# Altium project TankBoard.PrjPCB
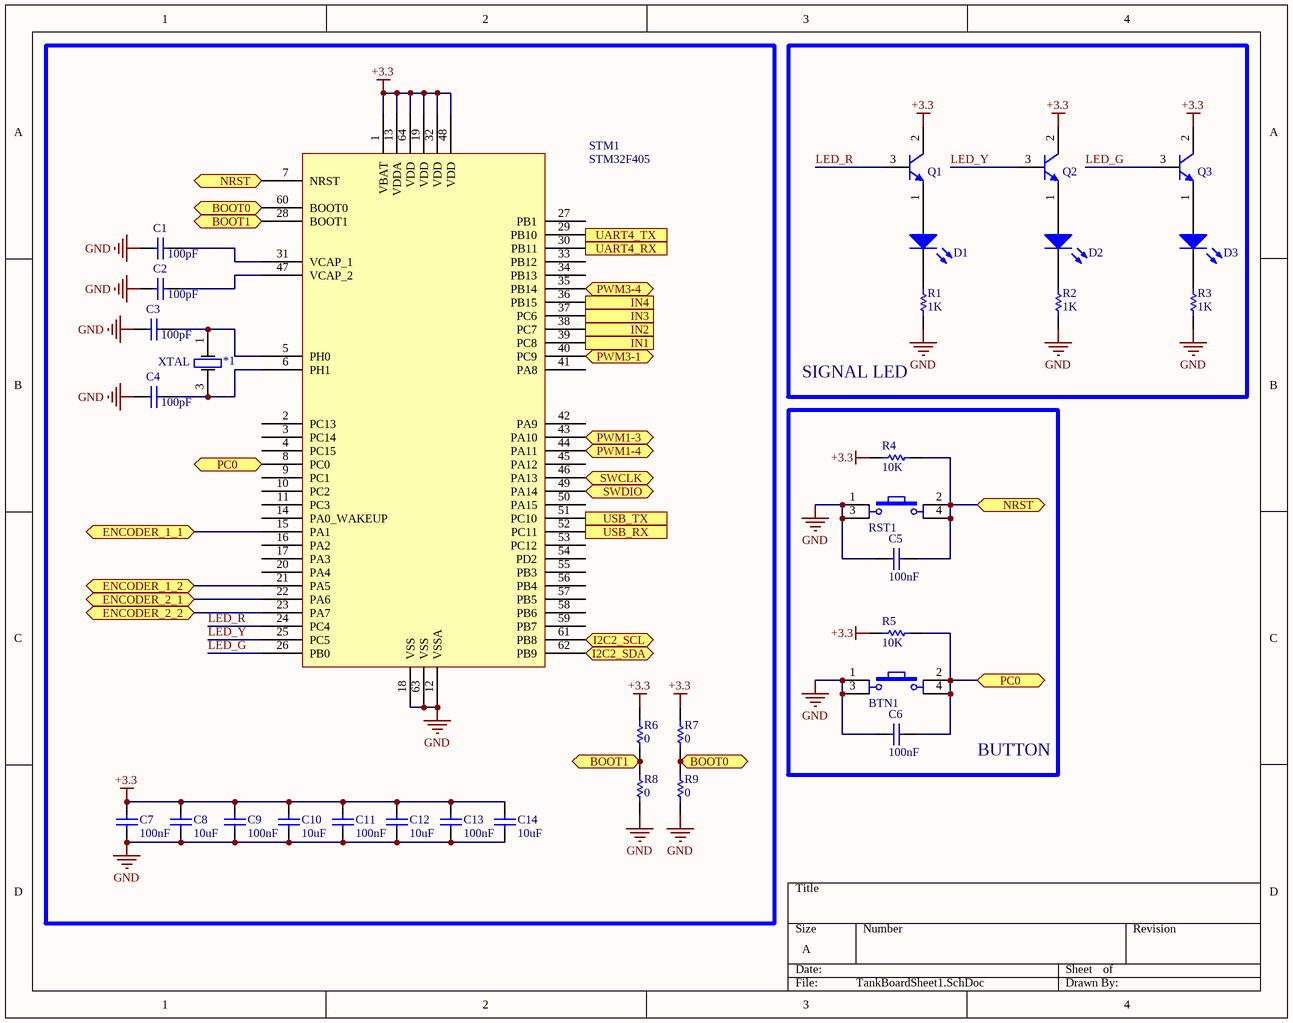
[diagram p0: TankBoardSheet1.SchDoc]
4 sheets, 87 parts. Net scope: flat (ports and power ports of the same name join across sheets).
Board file: TankBoardPCB1.PcbDoc
Sheets:
  TankBoardSheet1.SchDoc
  TankBoardSheet2.SchDoc
  TankBoardSheet3.SchDoc
  TankBoardSheet4.SchDoc

## Sheet TankBoardSheet1.SchDoc
size A

### Parts
*1  XTAL  [XTAL SMD 4PIN]
BTN1  SW  [Tact SW 4 pin]  (value not drawn)
C1  value 100pF  [CAP-SM-0603]  (hidden comment: Cap Non-Pol SMD)
C2  value 100pF  [CAP-SM-0603]  (hidden comment: Cap Non-Pol SMD)
C3  value 100pF  [CAP-SM-0603]  (hidden comment: Cap Non-Pol SMD)
C4  value 100pF  [CAP-SM-0603]  (hidden comment: Cap Non-Pol SMD)
C5  value 100nF  [CAP-SM-0603]  (hidden comment: Cap Non-Pol SMD)
C6  value 100nF  [CAP-SM-0603]  (hidden comment: Cap Non-Pol SMD)
C7  value 100nF  [CAP-SM-0603]  (hidden comment: Cap Non-Pol SMD)
C8  value 10uF  [CAP-SM-0603]  (hidden comment: Cap Non-Pol SMD)
C9  value 100nF  [CAP-SM-0603]  (hidden comment: Cap Non-Pol SMD)
C10  value 10uF  [CAP-SM-0603]  (hidden comment: Cap Non-Pol SMD)
C11  value 100nF  [CAP-SM-0603]  (hidden comment: Cap Non-Pol SMD)
C12  value 10uF  [CAP-SM-0603]  (hidden comment: Cap Non-Pol SMD)
C13  value 100nF  [CAP-SM-0603]  (hidden comment: Cap Non-Pol SMD)
C14  value 10uF  [CAP-SM-0603]  (hidden comment: Cap Non-Pol SMD)
D1  LED SMD  [LED_0603_Blue]  (value not drawn)
D2  LED SMD  [LED_0603_Blue]  (value not drawn)
D3  LED SMD  [LED_0603_Blue]  (value not drawn)
Q1  C1815  [SOT23B]  (value not drawn)
Q2  C1815  [SOT23B]  (value not drawn)
Q3  C1815  [SOT23B]  (value not drawn)
R1  value 1K  [RES-SM-0603]  (hidden comment: RESISTOR SMD)
R2  value 1K  [RES-SM-0603]  (hidden comment: RESISTOR SMD)
R3  value 1K  [RES-SM-0603]  (hidden comment: RESISTOR SMD)
R4  value 10K  [RES-SM-0603]  (hidden comment: RESISTOR SMD)
R5  value 10K  [RES-SM-0603]  (hidden comment: RESISTOR SMD)
R6  value 0  [RES-SM-0603]  (hidden comment: RESISTOR SMD)
R7  value 0  [RES-SM-0603]  (hidden comment: RESISTOR SMD)
R8  value 0  [RES-SM-0603]  (hidden comment: RESISTOR SMD)
R9  value 0  [RES-SM-0603]  (hidden comment: RESISTOR SMD)
RST1  SW  [Tact SW 4 pin]  (value not drawn)
STM1  STM32F405  [CQFP50P1150X1150X160-64N]

### Blocks framed on the sheet
SIGNAL LED: D1-D3 Q1-Q3 R1-R3
BUTTON: BTN1 C5 C6 R4 R5 RST1

### Ports
BOOT0 (bidir), BOOT1 (bidir), ENCODER_1_1 (bidir), ENCODER_1_2 (bidir), ENCODER_2_1 (bidir), ENCODER_2_2 (bidir), I2C2_SCL (bidir), I2C2_SDA (bidir), IN1 (out), IN2 (out), IN3 (out), IN4 (out), NRST (bidir), PC0 (bidir), PWM1-3 (bidir), PWM1-4 (bidir), PWM3-1 (bidir), PWM3-4 (bidir), SWCLK (bidir), SWDIO (bidir), UART4_RX (in), UART4_TX (out), USB_RX (in), USB_TX (out)

### Nets
+3.3: C7.1 C8.1 C9.1 C10.1 C11.1 C12.1 C13.1 C14.1 Q1.2(C) Q2.2(C) Q3.2(C) R4.1 R5.1 R6.2 R7.2 STM1.1(VBAT) STM1.13(VDDA) STM1.19(VDD) STM1.32(VDD) STM1.48(VDD) STM1.64(VDD)
GND: BTN1.1 BTN1.3 C1.1 C2.1 C3.1 C4.1 C5.2 C6.2 C7.2 C8.2 C9.2 C10.2 C11.2 C12.2 C13.2 C14.2 R1.1 R2.1 R3.1 R8.1 R9.1 RST1.1 RST1.3 STM1.12(VSSA) STM1.18(VSS) STM1.63(VSS)
LED_G: Q3.3(B) STM1.26(PB0)
LED_R: Q1.3(B) STM1.24(PC4)
LED_Y: Q2.3(B) STM1.25(PC5)
Net*1_1: *1.1 C3.2 STM1.5(PH0)
Net*1_3: *1.3 C4.2 STM1.6(PH1)
Net*2_25: STM1.51(PC10) ; port USB_TX
Net*2_26: STM1.52(PC11) ; port USB_RX
Net*4_2: STM1.15(PA1) ; port ENCODER_1_1
Net*4_4: STM1.21(PA5) ; port ENCODER_1_2
Net*4_10: STM1.23(PA7) ; port ENCODER_2_2
Net*4_12: STM1.22(PA6) ; port ENCODER_2_1
NetBTN1_2: BTN1.2 BTN1.4 C6.1 R5.2 STM1.8(PC0) ; port PC0
NetC1_2: C1.2 STM1.31(VCAP_1)
NetC2_2: C2.2 STM1.47(VCAP_2)
NetC5_1: C5.1 R4.2 RST1.2 RST1.4 STM1.7(NRST) ; port NRST
NetD1_1: D1.1(A) Q1.1(E)
NetD1_2: D1.2(K) R1.2
NetD2_1: D2.1(A) Q2.1(E)
NetD2_2: D2.2(K) R2.2
NetD3_1: D3.1(A) Q3.1(E)
NetD3_2: D3.2(K) R3.2
NetP1_2: STM1.29(PB10) ; port UART4_TX
NetP1_3: STM1.30(PB11) ; port UART4_RX
NetP2_1: STM1.44(PA11) ; port PWM1-4
NetP3_1: STM1.46(PA13) ; port SWCLK
NetP3_4: STM1.49(PA14) ; port SWDIO
NetP4_1: STM1.43(PA10) ; port PWM1-3
NetP5_3: STM1.61(PB8) ; port I2C2_SCL
NetP5_4: STM1.62(PB9) ; port I2C2_SDA
NetP6_3: STM1.35(PB14) ; port PWM3-4
NetP6_4: STM1.36(PB15) ; port IN4
NetP6_5: STM1.37(PC6) ; port IN3
NetP6_6: STM1.38(PC7) ; port IN2
NetP6_7: STM1.39(PC8) ; port IN1
NetP6_8: STM1.40(PC9) ; port PWM3-1
NetR6_1: R6.1 R8.2 STM1.28(BOOT1) ; port BOOT1
NetR7_1: R7.1 R9.2 STM1.60(BOOT0) ; port BOOT0

Not connected (* = marked no-connect by the designer): STM1 2(PC13) 3(PC14) 4(PC15) 9(PC1) 10(PC2) 11(PC3) 14(PA0_WAKEUP) 16(PA2) 17(PA3) 20(PA4) 27(PB1) 33(PB12) 34(PB13) 41(PA8) 42(PA9) 45(PA12) 50(PA15) 53(PC12) 54(PD2) 55(PB3) 56(PB4) 57(PB5) 58(PB6) 59(PB7)

### Library data of the parts
BTN1 RST1 = Tact SW - 4Pin: Switch button 4 pin; Value: Button chip 4 pin
C1-C14 = Cap Non-Pol SMD: Capacitor
D1-D3 = LED SMD: LED
Q1-Q3 = C1815: NPN Bipolar Transistor
R1-R9 = RESISTOR SMD: Resistor

## Sheet TankBoardSheet2.SchDoc
size A
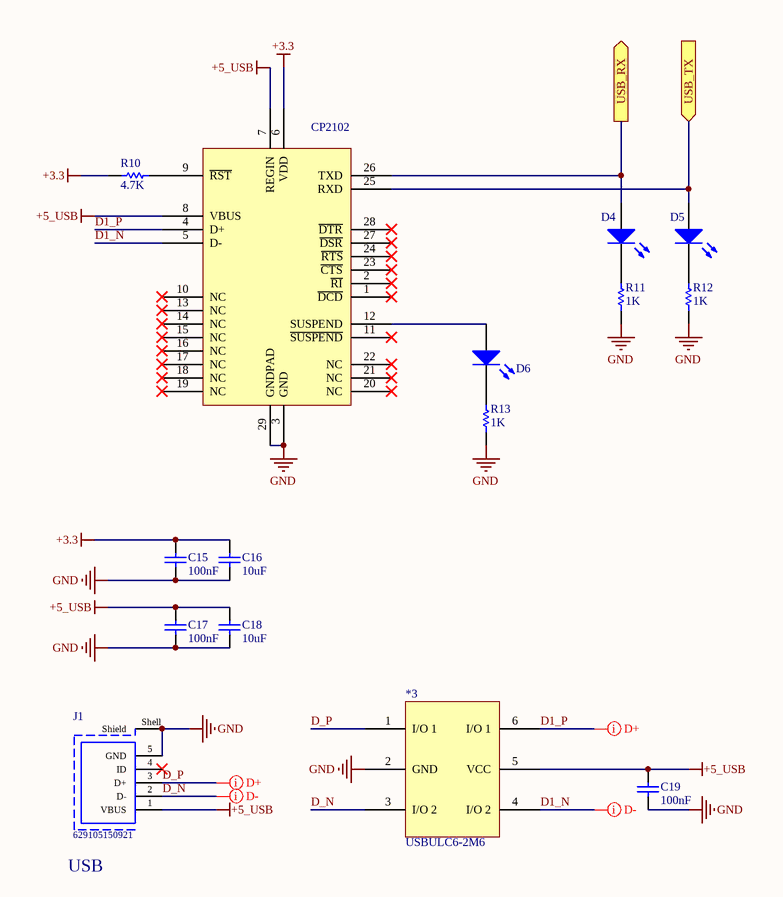
[diagram p1: TankBoardSheet2.SchDoc]

### Parts
*2  CP2102  [QFN50P500X500X90_HS-29N]
*3  USBULC6-2M6  [QFN50P100X145X60-6N]
C15  value 100nF  [CAP-SM-0603]  (hidden comment: Cap Non-Pol SMD)
C16  value 10uF  [CAP-SM-0603]  (hidden comment: Cap Non-Pol SMD)
C17  value 100nF  [CAP-SM-0603]  (hidden comment: Cap Non-Pol SMD)
C18  value 10uF  [CAP-SM-0603]  (hidden comment: Cap Non-Pol SMD)
C19  value 100nF  [CAP-SM-0603]  (hidden comment: Cap Non-Pol SMD)
D4  LED SMD  [LED_0603_Blue]  (value not drawn)
D5  LED SMD  [LED_0603_Blue]  (value not drawn)
D6  LED SMD  [LED_0603_Blue]  (value not drawn)
J1  629105150921  [629105150921]
R10  value 4.7K  [RES-SM-0603]  (hidden comment: RESISTOR SMD)
R11  value 1K  [RES-SM-0603]  (hidden comment: RESISTOR SMD)
R12  value 1K  [RES-SM-0603]  (hidden comment: RESISTOR SMD)
R13  value 1K  [RES-SM-0603]  (hidden comment: RESISTOR SMD)

### Ports
USB_RX (out), USB_TX (in)

### Nets
+3.3: *2.6(VDD) C15.1 C16.1 R10.2
+5_USB: *2.7(REGIN) *2.8(VBUS) *3.5(VCC) C17.1 C18.1 C19.1 J1.1(VBUS)
GND: *2.3(GND) *2.29(GNDPAD) *3.2(GND) C15.2 C16.2 C17.2 C18.2 C19.2 J1.5(GND) J1.Shell(Shield) R11.1 R12.1 R13.1
D1_N: *2.5(D-) *3.4(I/O_2)
D1_P: *2.4(D+) *3.6(I/O_1)
D_N: *3.3(I/O_2) J1.2(D-)
D_P: *3.1(I/O_1) J1.3(D+)
Net*2_9: *2.9(~{RST}) R10.1
Net*2_12: *2.12(SUSPEND) D6.1(A)
Net*2_25: *2.25(RXD) D5.1(A) ; port USB_TX
Net*2_26: *2.26(TXD) D4.1(A) ; port USB_RX
NetD4_2: D4.2(K) R11.2
NetD5_2: D5.2(K) R12.2
NetD6_2: D6.2(K) R13.2

Not connected (* = marked no-connect by the designer): *2 1(~{DCD})* 2(~{RI})* 10(NC)* 11(~{SUSPEND})* 13(NC)* 14(NC)* 15(NC)* 16(NC)* 17(NC)* 18(NC)* 19(NC)* 20(NC)* 21(NC)* 22(NC)* 23(~{CTS})* 24(~{RTS})* 27(~{DSR})* 28(~{DTR})*; J1 4(ID)*

### Layout directives
differential pair: D1_N, D1_P, D_N, D_P

### Notes on the sheet
- USB

### Library data of the parts
C15-C19 = Cap Non-Pol SMD: Capacitor
D4-D6 = LED SMD: LED
J1 = 629105150921: Micro USB 2.0 Type AB Receptacle WR-COM, Horizontal, SMT; Rated Current: 1.8 A; Contact Resistance: 30 mOhm; Working Voltage: 30 VAC; ComponentLink1Description: Manufacturer; ComponentLink1URL: http://www.we-online.de; ComponentLink2Description: Datasheet; ComponentLink2URL: https://katalog.we-online.de/em/datasheet/629105150921.pdf; Part Number: 629105150921; Published Date: September 2018; Publisher: Wurth Elektronik; Orientation: Horizontal; Connector Type: Micro USB 2.0 Type AB; Operating Temperature: -40 to 85 degC; Mounting Technology: SMT; Gender: Receptacle; Packaging: Tape and Reel
R10-R13 = RESISTOR SMD: Resistor

## Sheet TankBoardSheet3.SchDoc
size A
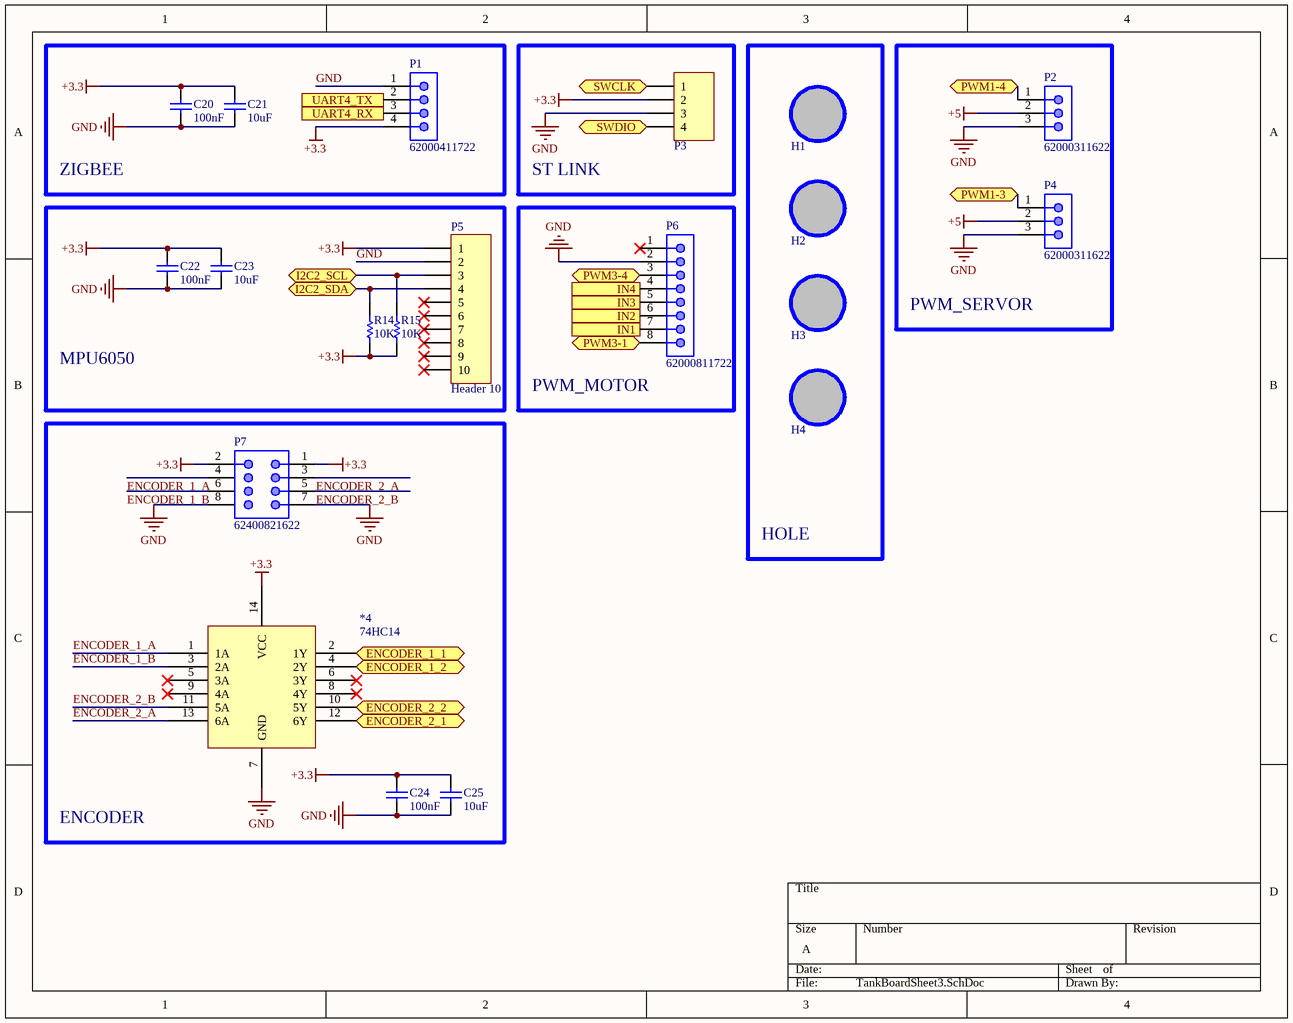
[diagram p2: TankBoardSheet3.SchDoc]

### Parts
*4  74HC14  [SOIC108P600X170-14N]
C20  value 100nF  [CAP-SM-0603]  (hidden comment: Cap Non-Pol SMD)
C21  value 10uF  [CAP-SM-0603]  (hidden comment: Cap Non-Pol SMD)
C22  value 100nF  [CAP-SM-0603]  (hidden comment: Cap Non-Pol SMD)
C23  value 10uF  [CAP-SM-0603]  (hidden comment: Cap Non-Pol SMD)
C24  value 100nF  [CAP-SM-0603]  (hidden comment: Cap Non-Pol SMD)
C25  value 10uF  [CAP-SM-0603]  (hidden comment: Cap Non-Pol SMD)
H1  Hole  [LO KHOAN 3MM]  (value not drawn)
H2  Hole  [LO KHOAN 3MM]  (value not drawn)
H3  Hole  [LO KHOAN 3MM]  (value not drawn)
H4  Hole  [LO KHOAN 3MM]  (value not drawn)
P1  62000411722  [62000411722]
P2  62000311622  [62000311622]
P3  Header 4  [JP4]  (value not drawn)
P4  62000311622  [62000311622]
P5  Header 10  [HDR1X10]
P6  62000811722  [62000811722]
P7  62400821622  [62400821622]
R14  value 10K  [RES-SM-0603]  (hidden comment: RESISTOR SMD)
R15  value 10K  [RES-SM-0603]  (hidden comment: RESISTOR SMD)

### Blocks framed on the sheet
ZIGBEE: C20 C21 P1
ST LINK: P3
HOLE: H1-H4
PWM_SERVOR: P2 P4
MPU6050: C22 C23 P5 R14 R15
PWM_MOTOR: P6
ENCODER: *4 C24 C25 P7

### Ports
ENCODER_1_1 (bidir), ENCODER_1_2 (bidir), ENCODER_2_1 (bidir), ENCODER_2_2 (bidir), I2C2_SCL (bidir), I2C2_SDA (bidir), IN1 (in), IN2 (in), IN3 (in), IN4 (in), PWM1-3 (bidir), PWM1-4 (bidir), PWM3-1 (bidir), PWM3-4 (bidir), SWCLK (bidir), SWDIO (bidir), UART4_RX (out), UART4_TX (in)

### Nets
+3.3: *4.14(VCC) C20.1 C21.1 C22.1 C23.1 C24.1 C25.1 P1.4 P3.2 P5.1 P7.1 P7.2 R14.1 R15.1
+5: P2.2 P4.2
GND: *4.7(GND) C20.2 C21.2 C22.2 C23.2 C24.2 C25.2 P1.1 P2.3 P3.3 P4.3 P5.2 P6.2 P7.7 P7.8
ENCODER_1_A: *4.1(1A) P7.4
ENCODER_1_B: *4.3(2A) P7.6
ENCODER_2_A: *4.13(6A) P7.3
ENCODER_2_B: *4.11(5A) P7.5
Net*4_2: *4.2(1Y) ; port ENCODER_1_1
Net*4_4: *4.4(2Y) ; port ENCODER_1_2
Net*4_10: *4.10(5Y) ; port ENCODER_2_2
Net*4_12: *4.12(6Y) ; port ENCODER_2_1
NetP1_2: P1.2 ; port UART4_TX
NetP1_3: P1.3 ; port UART4_RX
NetP2_1: P2.1 ; port PWM1-4
NetP3_1: P3.1 ; port SWCLK
NetP3_4: P3.4 ; port SWDIO
NetP4_1: P4.1 ; port PWM1-3
NetP5_3: P5.3 R15.2 ; port I2C2_SCL
NetP5_4: P5.4 R14.2 ; port I2C2_SDA
NetP6_3: P6.3 ; port PWM3-4
NetP6_4: P6.4 ; port IN4
NetP6_5: P6.5 ; port IN3
NetP6_6: P6.6 ; port IN2
NetP6_7: P6.7 ; port IN1
NetP6_8: P6.8 ; port PWM3-1

Not connected (* = marked no-connect by the designer): *4 5(3A)* 6(3Y)* 8(4Y)* 9(4A)*; H1 1; H2 1; H3 1; H4 1; P5 5* 6* 7* 8* 9* 10*; P6 1*

### Library data of the parts
C20-C25 = Cap Non-Pol SMD: Capacitor
H1-H4 = Hole: Hole 3mm
P1 = 62000411722: WR-WTB THT Male Horizontal Shrouded Header, pitch 2mm, 4p; Pin Number: 4; Contact Resistance: 20mOhm; Rated Current: 2A; Withstanding Voltage: 800VAC; Working Voltage: 125VAC; ComponentLink1Description: Manufacturer; ComponentLink1URL: http://www.we-online.de; ComponentLink2Description: Datasheet; ComponentLink2URL: https://www.we-online.com/catalog/datasheet/62000411722.pdf; Pitch: 2mm; Published Date: January 2020; Publisher: Wurth Elektronik; Mounting Technology: THT; Packaging: Bag; Operating Temperature: -25 to +85degC; Part Number: 62000411722; Gender: Male; Type: Horizontal
P2 P4 = 62000311622: WR-WTB Male Vertical Shrouded Header, pitch 2mm, 3p; Pin Number: 3; Contact Resistance: 20mOhm; Rated Current: 2A; Withstanding Voltage: 800VAC; Working Voltage: 125VAC; ComponentLink1Description: Manufacturer; ComponentLink1URL: http://www.we-online.de; ComponentLink2Description: Datasheet; ComponentLink2URL: https://www.we-online.com/catalog/datasheet/62000311622.pdf; Pitch: 2mm; Published Date: January 2020; Publisher: Wurth Elektronik; Mounting Technology: THT; Packaging: Bag; Operating Temperature: -25 to +85degC; Part Number: 62000311622; Gender: Male; Type: Vertical
P3 = Header 4: Header, 4-Pin; LatestRevisionDate: 17-Jul-2002; LatestRevisionNote: Re-released for DXP Platform.; Publisher: Altium Limited
P5 = Header 10: Header, 10-Pin; LatestRevisionDate: 17-Jul-2002; LatestRevisionNote: Re-released for DXP Platform.; Publisher: Altium Limited
P6 = 62000811722: WR-WTB THT Male Horizontal Shrouded Header, pitch 2mm, 8p; Pin Number: 8; Contact Resistance: 20mOhm; Rated Current: 2A; Withstanding Voltage: 800VAC; Working Voltage: 125VAC; ComponentLink1Description: Manufacturer; ComponentLink1URL: http://www.we-online.de; ComponentLink2Description: Datasheet; ComponentLink2URL: https://www.we-online.com/catalog/datasheet/62000811722.pdf; Pitch: 2mm; Published Date: January 2020; Publisher: Wurth Elektronik; Mounting Technology: THT; Packaging: Bag; Operating Temperature: -25 to +85degC; Part Number: 62000811722; Gender: Male; Type: Horizontal
P7 = 62400821622: WR-WTB THT Male Vertical Shrouded Header with positive locking, Dual Row, pitch 2mm, 8p; Pin Number: 8; Contact Resistance: 20mOhm; Rated Current: 3A; Withstanding Voltage: 1000VAC; Working Voltage: 250VAC; ComponentLink1Description: Manufacturer; ComponentLink1URL: http://www.we-online.de; ComponentLink2Description: Datasheet; ComponentLink2URL: https://www.we-online.com/catalog/datasheet/62400821622.pdf; Pitch: 2mm; Published Date: January 2020; Publisher: Wurth Elektronik; Mounting Technology: THT; Packaging: Tube; Operating Temperature: -25 to +85degC; Part Number: 62400821622; Gender: Male; Type: Vertical
R14 R15 = RESISTOR SMD: Resistor

## Sheet TankBoardSheet4.SchDoc
size A
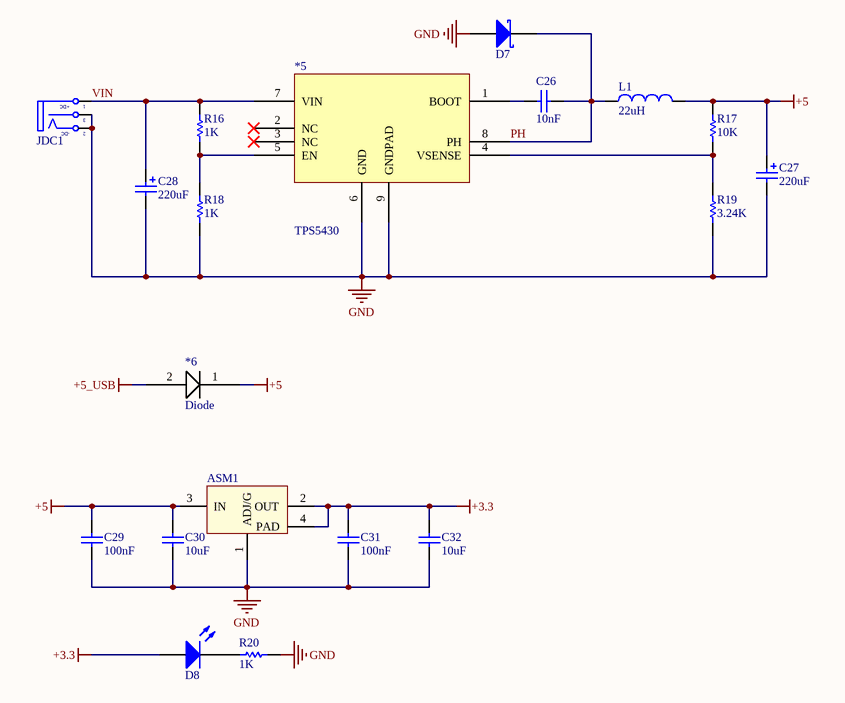
[diagram p3: TankBoardSheet4.SchDoc]

### Parts
*5  TPS5430  [SOIC127P600X170_HS-9N]
*6  Diode  [DIODE SMA (DO-214AC)]
ASM1  LM1117  [SOT223-4N]  (value not drawn)
C26  value 10nF  [CAP-SM-0603]  (hidden comment: Cap Non-Pol SMD)
C27  value 220uF  [CAP ALU SIZE D]  (hidden comment: Cap Pol SMD)
C28  value 220uF  [CAP ALU SIZE D]  (hidden comment: Cap Pol SMD)
C29  value 100nF  [CAP-SM-0603]  (hidden comment: Cap Non-Pol SMD)
C30  value 10uF  [CAP-SM-0603]  (hidden comment: Cap Non-Pol SMD)
C31  value 100nF  [CAP-SM-0603]  (hidden comment: Cap Non-Pol SMD)
C32  value 10uF  [CAP-SM-0603]  (hidden comment: Cap Non-Pol SMD)
D7  D Schottky  [SS34]  (value not drawn)
D8  LED SMD  [LED_0603_Blue]  (value not drawn)
JDC1  Jack DC  [DC-IN]  (value not drawn)
L1  value 22uH  [INDUCTOR 12.5x12.5]  (hidden comment: Inductor)
R16  value 1K  [RES-SM-0603]  (hidden comment: RESISTOR SMD)
R17  value 10K  [RES-SM-0603]  (hidden comment: RESISTOR SMD)
R18  value 1K  [RES-SM-0603]  (hidden comment: RESISTOR SMD)
R19  value 3.24K  [RES-SM-0603]  (hidden comment: RESISTOR SMD)
R20  value 1K  [RES-SM-0603]  (hidden comment: RESISTOR SMD)

### Nets
+3.3: ASM1.2(OUT) ASM1.4(PAD) C31.1 C32.1 D8.1(A)
+5: *6.1 ASM1.3(IN) C27.1 C29.1 C30.1 L1.2 R17.2
+5_USB: *6.2
GND: *5.6(GND) *5.9(GNDPAD) ASM1.1(ADJ/G) C27.2 C28.2 C29.2 C30.2 C31.2 C32.2 D7.1(A) JDC1.2(TN) JDC1.3(S) R18.1 R19.1 R20.1
PH: *5.8(PH) C26.1 D7.2(K) L1.1
VIN: *5.7(VIN) C28.1 JDC1.1(T) R16.2
Net*5_1: *5.1(BOOT) C26.2
Net*5_4: *5.4(VSENSE) R17.1 R19.2
Net*5_5: *5.5(EN) R16.1 R18.2
NetD8_2: D8.2(K) R20.2

Not connected (* = marked no-connect by the designer): *5 2(NC)* 3(NC)*

### Notes on the sheet
- (in symbol Jack DC) +DC; -DC

### Library data of the parts
ASM1 = LM1117: Available in 1.8V, 2.5V, 2.85V, 3.3V, 5V, and  Adjustable Versions; Value: LM317
C26 C29-C32 = Cap Non-Pol SMD: Capacitor
C27 C28 = Cap Pol SMD: Polarized Capacitor (Radial)
D7 = D Schottky: Schottky Diode; Published: 8-Jun-2000; LatestRevisionDate: 17-Jul-2002; LatestRevisionNote: Re-released for DXP Platform.; PackageReference: SMB; Publisher: Altium Limited; PackageDescription: DO-214-AA/SMB; 2 C-Bend Leads; Body 5.3 x 3.6 mm, inc. leads (LxW); Code_JEDEC: DO-214-AA
D8 = LED SMD: LED
JDC1 = Jack DC: Jack DC input; Value: Jac DC
R16-R20 = RESISTOR SMD: Resistor

## Nets that join several sheets
+3.3: TankBoardSheet1 (21 pins), TankBoardSheet2 (*2.6 C15.1 C16.1 R10.2), TankBoardSheet3 (14 pins), TankBoardSheet4 (5 pins)
+5: TankBoardSheet3 (P2.2 P4.2), TankBoardSheet4 (7 pins)
+5_USB: TankBoardSheet2 (7 pins), TankBoardSheet4 (*6.2)
GND: TankBoardSheet1 (26 pins), TankBoardSheet2 (13 pins), TankBoardSheet3 (15 pins), TankBoardSheet4 (15 pins)
Net*2_25: TankBoardSheet1 (STM1.51), TankBoardSheet2 (*2.25 D5.1)
Net*2_26: TankBoardSheet1 (STM1.52), TankBoardSheet2 (*2.26 D4.1)
Net*4_2: TankBoardSheet1 (STM1.15), TankBoardSheet3 (*4.2)
Net*4_4: TankBoardSheet1 (STM1.21), TankBoardSheet3 (*4.4)
Net*4_10: TankBoardSheet1 (STM1.23), TankBoardSheet3 (*4.10)
Net*4_12: TankBoardSheet1 (STM1.22), TankBoardSheet3 (*4.12)
NetP1_2: TankBoardSheet1 (STM1.29), TankBoardSheet3 (P1.2)
NetP1_3: TankBoardSheet1 (STM1.30), TankBoardSheet3 (P1.3)
NetP2_1: TankBoardSheet1 (STM1.44), TankBoardSheet3 (P2.1)
NetP3_1: TankBoardSheet1 (STM1.46), TankBoardSheet3 (P3.1)
NetP3_4: TankBoardSheet1 (STM1.49), TankBoardSheet3 (P3.4)
NetP4_1: TankBoardSheet1 (STM1.43), TankBoardSheet3 (P4.1)
NetP5_3: TankBoardSheet1 (STM1.61), TankBoardSheet3 (P5.3 R15.2)
NetP5_4: TankBoardSheet1 (STM1.62), TankBoardSheet3 (P5.4 R14.2)
NetP6_3: TankBoardSheet1 (STM1.35), TankBoardSheet3 (P6.3)
NetP6_4: TankBoardSheet1 (STM1.36), TankBoardSheet3 (P6.4)
NetP6_5: TankBoardSheet1 (STM1.37), TankBoardSheet3 (P6.5)
NetP6_6: TankBoardSheet1 (STM1.38), TankBoardSheet3 (P6.6)
NetP6_7: TankBoardSheet1 (STM1.39), TankBoardSheet3 (P6.7)
NetP6_8: TankBoardSheet1 (STM1.40), TankBoardSheet3 (P6.8)